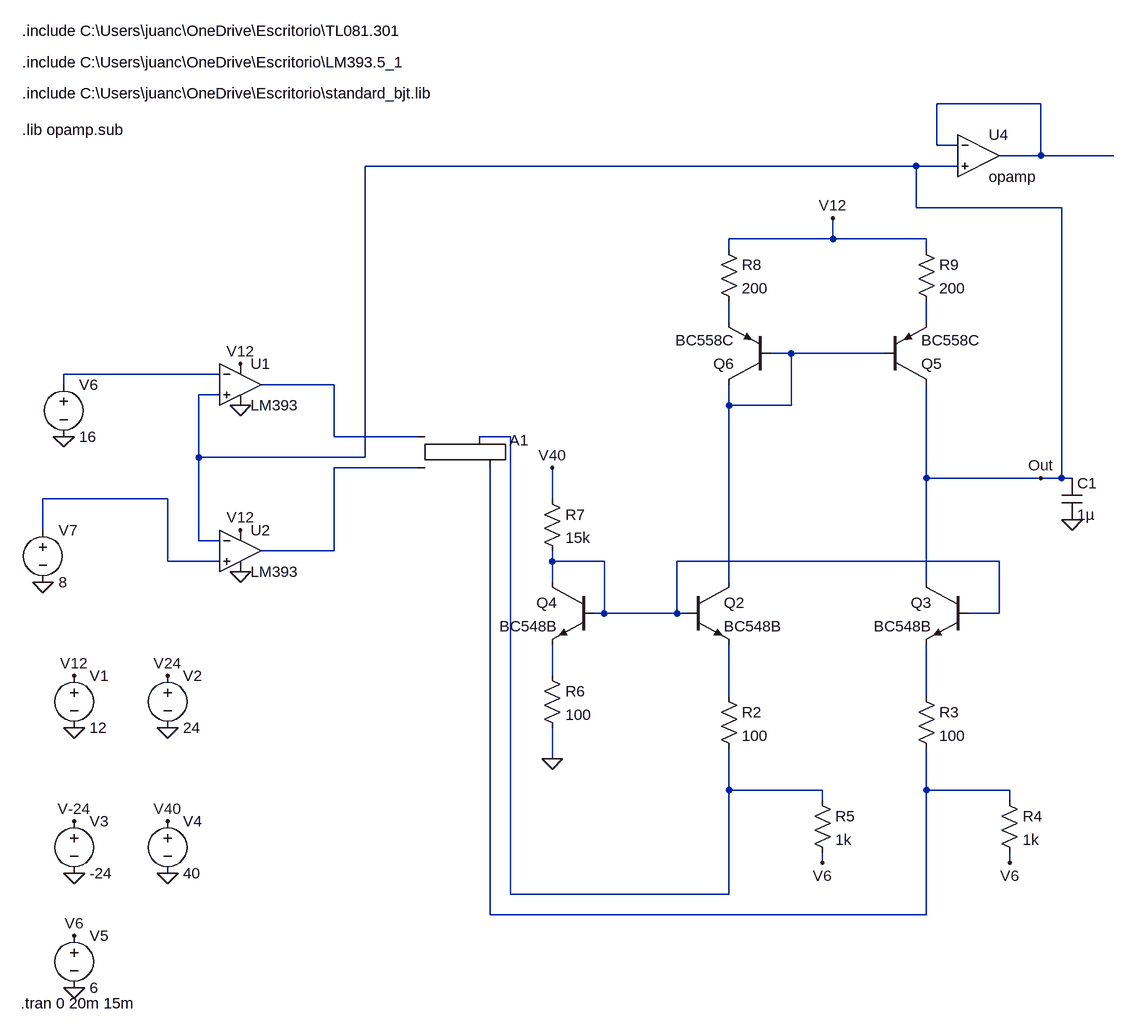
[diagram p0: schematic Gen_triangular_prueba4_sin_Fcorr_entrada.asc]
Gen_triangular_prueba4_sin_Fcorr_entrada.asc, the LTspice schematic file:
Version 4
SHEET 1 1388 1016
WIRE 928 -384 768 -384
WIRE 768 -320 768 -384
WIRE 800 -320 768 -320
WIRE 928 -304 928 -384
WIRE 928 -304 864 -304
WIRE 1040 -304 928 -304
WIRE 736 -288 -112 -288
WIRE 800 -288 736 -288
WIRE 736 -224 736 -288
WIRE 960 -224 736 -224
WIRE 608 -176 608 -208
WIRE 608 -176 448 -176
WIRE 752 -176 608 -176
WIRE 448 -160 448 -176
WIRE 752 -160 752 -176
WIRE 448 -48 448 -80
WIRE 752 -48 752 -80
WIRE 544 0 512 0
WIRE 688 0 544 0
WIRE -336 32 -576 32
WIRE -576 48 -576 32
WIRE -160 48 -272 48
WIRE -336 64 -368 64
WIRE 448 80 448 48
WIRE 544 80 544 0
WIRE 544 80 448 80
WIRE -160 128 -160 48
WIRE -32 128 -160 128
WIRE 112 128 64 128
WIRE -368 160 -368 64
WIRE -112 160 -112 -288
WIRE -112 160 -368 160
WIRE -32 176 -160 176
WIRE 752 192 752 48
WIRE 928 192 752 192
WIRE 960 192 960 -224
WIRE 960 192 928 192
WIRE 976 192 960 192
WIRE -416 224 -608 224
WIRE 176 224 176 176
WIRE -608 272 -608 224
WIRE -368 288 -368 160
WIRE -336 288 -368 288
WIRE -160 304 -160 176
WIRE -160 304 -272 304
WIRE -416 320 -416 224
WIRE -336 320 -416 320
WIRE 176 320 176 304
WIRE 256 320 176 320
WIRE 864 320 368 320
WIRE 176 352 176 320
WIRE 448 352 448 80
WIRE 752 352 752 192
WIRE 256 400 256 320
WIRE 256 400 240 400
WIRE 368 400 368 320
WIRE 368 400 256 400
WIRE 384 400 368 400
WIRE 864 400 864 320
WIRE 864 400 816 400
WIRE 176 496 176 448
WIRE 448 528 448 448
WIRE 752 528 752 448
WIRE 176 624 176 576
WIRE 448 672 448 608
WIRE 592 672 448 672
WIRE 752 672 752 608
WIRE 880 672 752 672
WIRE 592 688 592 672
WIRE 880 688 880 672
WIRE 592 784 592 768
WIRE 880 784 880 768
WIRE 112 832 112 128
WIRE 448 832 448 672
WIRE 448 832 112 832
WIRE 80 864 80 176
WIRE 752 864 752 672
WIRE 752 864 80 864
FLAG -304 80 0
FLAG -304 336 0
FLAG -304 16 V12
FLAG -304 272 V12
FLAG 176 624 0
FLAG 880 784 V6
FLAG 592 784 V6
FLAG 176 176 V40
FLAG 976 256 0
FLAG 608 -208 V12
FLAG 928 192 Out
FLAG -560 576 0
FLAG -416 576 0
FLAG -560 496 V12
FLAG -416 496 V24
FLAG -560 800 0
FLAG -560 720 V-24
FLAG -416 800 0
FLAG -416 720 V40
FLAG -560 976 0
FLAG -560 896 V6
FLAG -608 352 0
FLAG -576 128 0
SYMBOL Opamps\\opamp2 -304 -16 R0
SYMATTR InstName U1
SYMATTR Value LM393
SYMBOL Opamps\\opamp2 -304 240 R0
SYMATTR InstName U2
SYMATTR Value LM393
SYMBOL Digital\\srflop 16 80 R0
SYMATTR InstName A1
SYMBOL npn 384 352 R0
SYMATTR InstName Q2
SYMATTR Value BC548B
SYMBOL npn 816 352 M0
SYMATTR InstName Q3
SYMATTR Value BC548B
SYMBOL res 432 512 R0
SYMATTR InstName R2
SYMATTR Value 100
SYMBOL res 736 512 R0
SYMATTR InstName R3
SYMATTR Value 100
SYMBOL res 864 672 R0
SYMATTR InstName R4
SYMATTR Value 1k
SYMBOL res 576 672 R0
SYMATTR InstName R5
SYMATTR Value 1k
SYMBOL npn 240 352 M0
SYMATTR InstName Q4
SYMATTR Value BC548B
SYMBOL res 160 480 R0
SYMATTR InstName R6
SYMATTR Value 100
SYMBOL res 160 208 R0
SYMATTR InstName R7
SYMATTR Value 15k
SYMBOL cap 960 192 R0
SYMATTR InstName C1
SYMATTR Value 1µ
SYMBOL pnp 688 48 M180
SYMATTR InstName Q5
SYMATTR Value BC558C
SYMBOL pnp 512 48 R180
SYMATTR InstName Q6
SYMATTR Value BC558C
SYMBOL res 432 -176 R0
SYMATTR InstName R8
SYMATTR Value 200
SYMBOL res 736 -176 R0
SYMATTR InstName R9
SYMATTR Value 200
SYMBOL voltage -560 480 R0
WINDOW 123 0 0 Left 0
WINDOW 39 0 0 Left 0
SYMATTR InstName V1
SYMATTR Value 12
SYMBOL voltage -416 480 R0
WINDOW 123 0 0 Left 0
WINDOW 39 0 0 Left 0
SYMATTR InstName V2
SYMATTR Value 24
SYMBOL voltage -560 704 R0
WINDOW 123 0 0 Left 0
WINDOW 39 0 0 Left 0
SYMATTR InstName V3
SYMATTR Value -24
SYMBOL voltage -416 704 R0
WINDOW 123 0 0 Left 0
WINDOW 39 0 0 Left 0
SYMATTR InstName V4
SYMATTR Value 40
SYMBOL voltage -560 880 R0
WINDOW 123 0 0 Left 0
WINDOW 39 0 0 Left 0
SYMATTR InstName V5
SYMATTR Value 6
SYMBOL voltage -576 32 R0
WINDOW 123 0 0 Left 0
WINDOW 39 0 0 Left 0
SYMATTR InstName V6
SYMATTR Value 16
SYMBOL voltage -608 256 R0
WINDOW 123 0 0 Left 0
WINDOW 39 0 0 Left 0
SYMATTR InstName V7
SYMATTR Value 8
SYMBOL Opamps\\opamp 832 -368 R0
SYMATTR InstName U4
TEXT -640 -400 Left 2 !.include C:\\Users\\juanc\\OneDrive\\Escritorio\\standard_bjt.lib
TEXT -640 -448 Left 2 !.include C:\\Users\\juanc\\OneDrive\\Escritorio\\LM393.5_1
TEXT -640 -496 Left 2 !.include C:\\Users\\juanc\\OneDrive\\Escritorio\\TL081.301
TEXT -642 1000 Left 2 !.tran 0 20m 15m
TEXT -640 -344 Left 2 !.lib opamp.sub

The netlist it stands for:
* Gen_triangular_prueba4_sin_Fcorr_entrada.asc
XU1 Out N005 V12 0 N006 LM393  ; pins In+ In- V+ V- OUT
XU2 N009 Out V12 0 N008 LM393  ; pins In+ In- V+ V- OUT
A1 N006 N008 0 0 0 N014 N007 0 SRFLOP
Q2 N004 N010 N012 0 BC548B
Q3 Out N010 N013 0 BC548B
R2 N012 N007 100
R3 N013 N014 100
R4 N014 V6 1k
R5 N007 V6 1k
Q4 N010 N010 N011 0 BC548B
R6 N011 0 100
R7 V40 N010 15k
C1 Out 0 1µ
Q5 Out N004 N003 0 BC558C
Q6 N004 N004 N002 0 BC558C
R8 V12 N002 200
R9 V12 N003 200
V1 V12 0 12
V2 V24 0 24
V3 V-24 0 -24
V4 V40 0 40
V5 V6 0 6
V6 N005 0 16
V7 N009 0 8
XU4 N001 Out N001 opamp Aol=100K GBW=10Meg  ; pins invin noninvin out
.model NPN NPN
.model PNP PNP
.lib standard.bjt
.include C:\Users\juanc\OneDrive\Escritorio\standard_bjt.lib
.include C:\Users\juanc\OneDrive\Escritorio\LM393.5_1
.include C:\Users\juanc\OneDrive\Escritorio\TL081.301
.tran 0 20m 15m
.lib opamp.sub
.backanno
.end